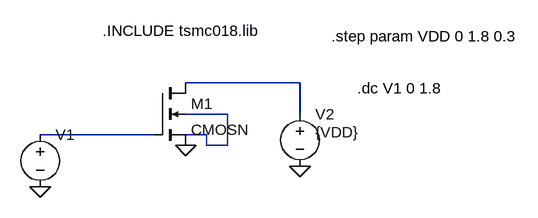
[diagram p0: schematic Exp-2 nMOS ch - ID vs VGS.asc]
Exp-2 nMOS ch - ID vs VGS.asc, the LTspice schematic file:
Version 4
SHEET 1 880 680
WIRE 368 96 192 96
WIRE 256 144 192 144
WIRE 368 144 368 96
WIRE 144 176 -32 176
WIRE 224 176 192 176
WIRE 224 192 224 176
WIRE 256 192 256 144
WIRE 256 192 224 192
FLAG -32 256 0
FLAG 368 224 0
FLAG 192 192 0
SYMBOL cmosn 144 96 R0
SYMATTR InstName M1
SYMATTR Value2 l=180n w=400n
SYMBOL voltage -32 160 R0
WINDOW 123 0 0 Left 0
WINDOW 39 0 0 Left 0
SYMATTR InstName V1
SYMATTR Value ""
SYMBOL voltage 368 128 R0
WINDOW 123 0 0 Left 0
WINDOW 39 0 0 Left 0
WINDOW 3 24 44 Left 2
SYMATTR InstName V2
SYMATTR Value {VDD}
TEXT 64 16 Left 2 !.INCLUDE tsmc018.lib
TEXT 416 24 Left 2 !.step param VDD 0 1.8 0.3
TEXT 456 104 Left 2 !.dc V1 0 1.8

The netlist it stands for:
* Exp-2 nMOS ch - ID vs VGS.asc
M1 N001 N003 0 N002 CMOSN l=180n w=400n
V1 N003 0
V2 N001 0 {VDD}
.model NMOS NMOS
.model PMOS PMOS
.lib standard.mos
.INCLUDE tsmc018.lib
.step param VDD 0 1.8 0.3
.dc V1 0 1.8
.backanno
.end